# EasyEDA Pro project NavBot-EN01.epro, board CODER
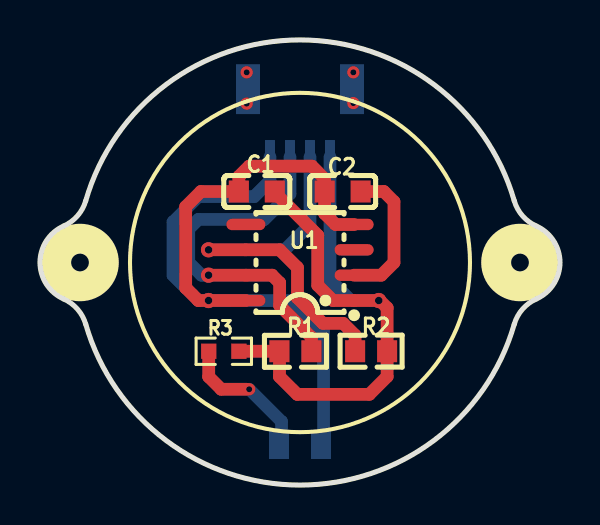
[diagram p10: board, top side]
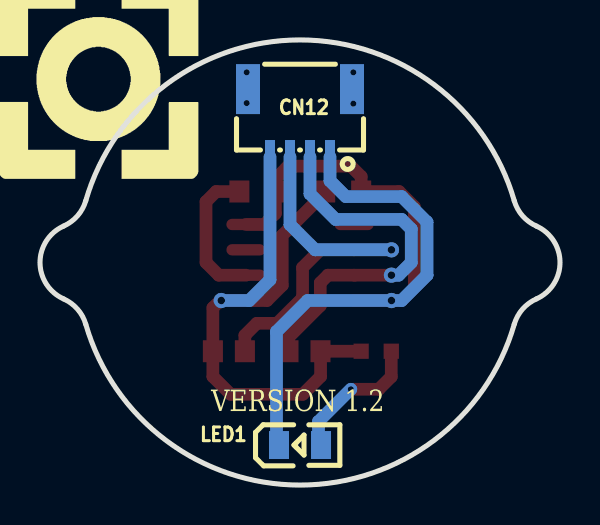
[diagram p11: board, bottom side, seen from below]

Outline 26 x 22.3 mm; copper layers: Top Layer, Bottom Layer. Coordinates in mm from the lower left corner of the outline.
Outline path: 1.18,9.32 arc(0,11.15) 1.18,12.98 arc(1.88,13.49) 2.29,14.25 arc(13,22.3) 23.71,14.25 arc(24.12,13.49) 24.82,12.98 arc(26,11.15) 24.82,9.32 arc(24.12,8.81) 23.71,8.05 arc(13,0) 2.29,8.05 arc(1.88,8.81) 1.18,9.32
Stack: Top Layer 0.035mm / Dielectric1 1.51mm FR4 er 4.5 / Bottom Layer 0.035mm

## Design rules (mm)
spacing Default (default): track to track 0.152, other pairs 0 to 0.152
track width Default (default): min 0.254, default 0.254, max 25.4
differential pair differentialPair (default): width min 0.127, default 0.254, max 2.54; gap min 0.152, default 0.152
via Default (default): diameter min 0.61, default 0.61, max 100.025; hole min 0.305, default 0.305, max 59.995

## Placement (name value [footprint] x y rotation side)
C1  100nf  [C0603]  10.84 14.71 0 top
C2  1uf  [C0603]  15.13 14.71 0 top
CN12  WAFER-SH1.0-4PWB  [CONN-SMD_4P-P1.00_WAFER-SH1.0-4PWB]  13 18.13 0 bottom
LED1  NCD0805R1  [LED0805-R-RD]  13 2.01 180 bottom
R1  4.7K  [R0603]  12.77 6.7 180 top
R2  4.7K  [R0603]  16.56 6.7 0 top
R3  1kΩ  [R0603#2]  9.19 6.7 180 top
U1  AS5600-ASOM  [SOIC-8_L5.0-W4.0-P1.27-LS6.0-BL]  13 11.15 90 top

## Footprints (pads in the part's own frame, mm; a bottom-side part is the same pattern mirrored in y, then rotated)
C0603
  rect 1x1.1 smd: 1(-0.9,0) 2(0.9,0)
CONN-SMD_4P-P1.00_WAFER-SH1.0-4PWB
  rect 0.5x1.7 smd: 1(-1.5,1.7) 2(-0.5,1.7) 3(0.5,1.7) 4(1.5,1.7)
  rect 1.2x2.5 smd: 5(-2.6,-1.7) 6(2.6,-1.7)
LED0805-R-RD
  rect 1x1.399 smd: 1(1.05,0) 2(-1.05,0)
R0603
  rect 1x1.1 smd: 1(-0.8,0) 2(0.8,0)
R0603#2
  rect 0.762x0.762 smd: 1(-0.753,0) 2(0.753,0)
SOIC-8_L5.0-W4.0-P1.27-LS6.0-BL
  oval 0.569x1.95 smd: 1(-1.905,-2.705) 2(-0.635,-2.705) 3(0.635,-2.705) 4(1.905,-2.705) 5(1.905,2.705) 6(0.635,2.705) 7(-0.635,2.705) 8(-1.905,2.705)

## Nets
As in the schematic.

Pads without a net: CN12 5 6; U1 3 5

## Via types
v1: diameter 0.61, hole 0.305, Top Layer to Bottom Layer, 5 vias
v2: diameter 0.762, hole 0.381, Top Layer to Bottom Layer, 4 vias

## Routing (per net, layer and track width the routed paths; a pad name or vN(x,y) marks a point on that pad's centre or on a via; arc(x,y) is an arc through that point)
GND: length 43.3
  Top Layer w0.635: U1.4 14.78,13.05 14.23,13.6 C2.1 14.23,15.34 13.6,15.98 10.46,15.98 9.94,15.46 C1.1 8.05,14.71 7.29,13.94 7.29,9.88 7.92,9.24 v2(8.43,9.24) U1.8
  Bottom Layer w0.635: 14.18,1.88 14.18,7.69 12.62,9.24 v2(8.43,9.24) 7.92,9.24 6.65,10.51 6.65,13.18 7.92,14.45 10.71,14.45 11.5,15.24 CN12.1
VCC: length 31.4
  Top Layer w0.635: C1.2 11.74,14.66 13.89,12.51 13.89,10.01 14.65,9.24 U1.1 v2(16.94,9.24) 16.99,9.24 17.36,8.88 R2.2 17.36,5.43 16.47,4.55 12.86,4.55 11.97,5.43 R1.2 R3.1
  Bottom Layer w0.635: v2(16.94,9.24) 15.54,9.24 14.5,10.28 CN12.4
VCC3.3: length 7.2
  Top Layer w0.635: U1.2 17.06,10.51 17.7,11.15 17.7,14.2 17.19,14.71 C2.2
(no net):
  vias: v1(10.33,20.67) v1(10.33,19.11) v1(15.67,20.67) v1(15.67,19.13)
SCL: length 18.4
  Top Layer w0.635: v2(8.43,10.51) U1.7 11.6,10.51 11.98,10.13 11.98,8.99 13.57,7.4 R1.1
  Bottom Layer w0.635: v2(8.43,10.51) 8.07,10.51 7.44,11.15 7.44,12.83 7.92,13.31 11.22,13.31 12.5,14.59 CN12.2
SDA: length 19.8
  Top Layer w0.635: v2(8.43,11.78) U1.6 11.98,11.78 12.87,10.9 12.87,9.37 14.14,8.1 15.16,8.1 15.76,7.5 R2.1
  Bottom Layer w0.635: CN12.3 13.5,13.05 12.24,11.78 v2(8.43,11.78)
$1N565: length 7
  Top Layer w0.635: 10.33,4.8 9.06,4.8 8.44,5.43 R3.2
  Bottom Layer w0.635: v1(10.46,4.8) 12.08,3.18 12.08,1.88

## Text on the board
Bottom Silkscreen Layer: VERSION 1.2
